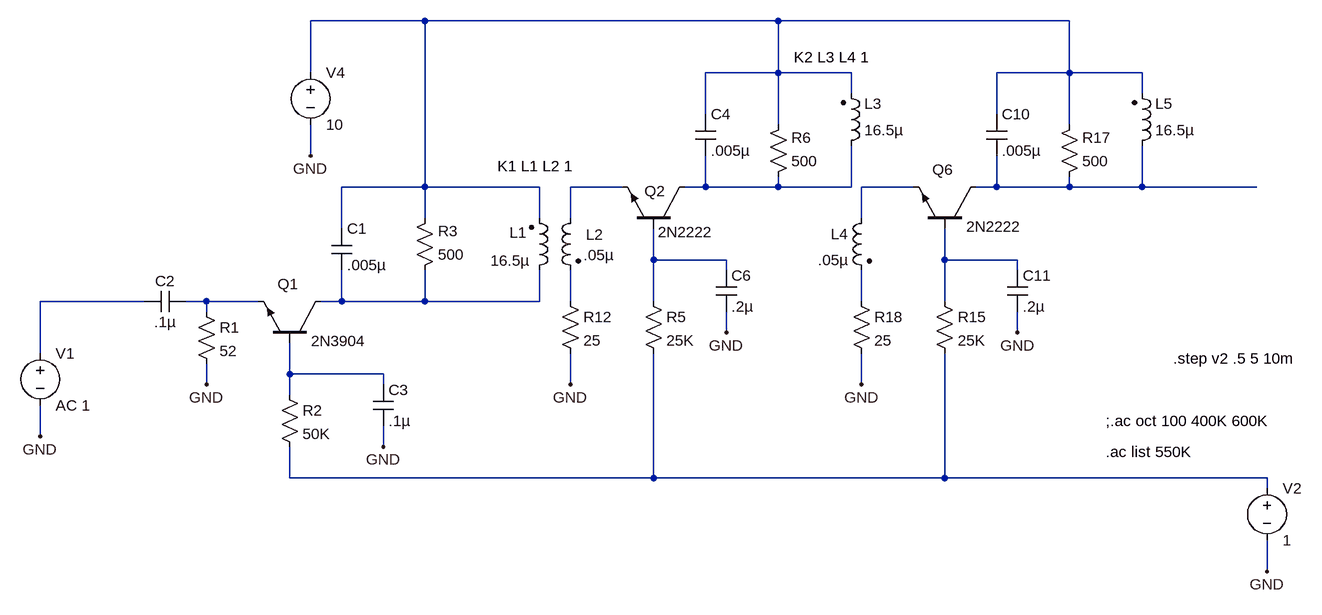
[diagram p0: schematic tmp.asc]
tmp.asc, the LTspice schematic file:
Version 4
SHEET 1 3740 1748
WIRE 1776 1312 1808 1312
WIRE 2112 1312 2112 1264
WIRE 1808 1312 1808 1264
WIRE 1808 1312 1936 1312
WIRE 1808 1136 1936 1136
WIRE 2112 1184 2112 1136
WIRE 1808 1200 1808 1136
WIRE 1680 1312 1600 1312
WIRE 1600 1312 1600 1328
WIRE 1600 1408 1600 1440
WIRE 1600 1312 1568 1312
WIRE 1344 1312 1344 1392
WIRE 1344 1472 1344 1520
WIRE 1728 1376 1728 1424
WIRE 1728 1536 1728 1584
WIRE 1728 1424 1728 1456
WIRE 1728 1424 1872 1424
WIRE 1872 1424 1872 1440
WIRE 1872 1504 1872 1536
WIRE 1936 1136 1936 880
WIRE 1936 1136 2112 1136
WIRE 1936 1136 1936 1184
WIRE 1936 1264 1936 1312
WIRE 1936 1312 2112 1312
WIRE 2336 1136 2368 1136
WIRE 2592 1136 2592 1072
WIRE 2368 1136 2368 1088
WIRE 2368 1136 2480 1136
WIRE 2368 960 2480 960
WIRE 2592 992 2592 960
WIRE 2368 1024 2368 960
WIRE 2240 1136 2160 1136
WIRE 2288 1200 2288 1248
WIRE 2288 1248 2288 1312
WIRE 2288 1248 2400 1248
WIRE 2400 1248 2400 1264
WIRE 2400 1328 2400 1360
WIRE 2480 960 2592 960
WIRE 2480 960 2480 1040
WIRE 2480 1120 2480 1136
WIRE 2480 1136 2592 1136
WIRE 2160 1136 2160 1184
WIRE 2160 1264 2160 1312
WIRE 1760 1088 1760 1040
WIRE 1760 960 1760 880
WIRE 1760 880 1936 880
WIRE 1936 880 2480 880
WIRE 2480 880 2928 880
WIRE 1504 1312 1344 1312
WIRE 2288 1392 2288 1584
WIRE 2288 1584 1728 1584
WIRE 3216 1136 3040 1136
WIRE 2160 1392 2160 1440
WIRE 2480 960 2480 880
WIRE 3232 1584 2736 1584
WIRE 3040 1136 3040 1072
WIRE 2816 1136 2816 1088
WIRE 2816 960 2928 960
WIRE 3040 992 3040 960
WIRE 2816 1024 2816 960
WIRE 2736 1200 2736 1248
WIRE 2736 1248 2736 1312
WIRE 2736 1248 2848 1248
WIRE 2848 1248 2848 1264
WIRE 2848 1328 2848 1360
WIRE 2928 960 3040 960
WIRE 2928 960 2928 1040
WIRE 2928 1120 2928 1136
WIRE 2608 1136 2608 1184
WIRE 2608 1264 2608 1312
WIRE 2736 1392 2736 1584
WIRE 2608 1392 2608 1440
WIRE 2928 960 2928 880
WIRE 2688 1136 2608 1136
WIRE 2816 1136 2784 1136
WIRE 3040 1136 2928 1136
WIRE 2736 1584 2288 1584
WIRE 2928 1136 2816 1136
WIRE 3232 1584 3232 1600
WIRE 3232 1680 3232 1728
FLAG 1600 1440 GND
FLAG 1344 1520 GND
FLAG 1872 1536 GND
FLAG 2400 1360 GND
FLAG 2160 1440 GND
FLAG 1760 1088 GND
FLAG 2848 1360 GND
FLAG 2608 1440 GND
FLAG 3232 1728 GND
SYMBOL npn 1776 1376 M270
WINDOW 0 91 67 VLeft 0
WINDOW 3 3 15 VLeft 0
SYMATTR InstName Q1
SYMATTR Value 2N3904
SYMBOL ind2 2096 1280 M180
WINDOW 0 -3 74 Right 0
WINDOW 3 2 31 Right 0
SYMATTR InstName L1
SYMATTR Value 16.5µ
SYMBOL cap 1792 1264 M180
WINDOW 0 24 64 Left 0
WINDOW 3 24 8 Left 0
SYMATTR InstName C1
SYMATTR Value .005µ
SYMBOL res 1584 1312 R0
SYMATTR InstName R1
SYMATTR Value 52
SYMBOL cap 1568 1296 R90
WINDOW 0 0 32 VBottom 0
WINDOW 3 32 32 VTop 0
SYMATTR InstName C2
SYMATTR Value .1µ
SYMBOL voltage 1344 1376 R0
SYMATTR InstName V1
SYMATTR Value AC 1
SYMBOL res 1712 1440 R0
SYMATTR InstName R2
SYMATTR Value 50K
SYMBOL cap 1856 1440 R0
SYMATTR InstName C3
SYMATTR Value .1µ
SYMBOL res 1920 1280 M180
WINDOW 0 36 76 Left 0
WINDOW 3 36 40 Left 0
SYMATTR InstName R3
SYMATTR Value 500
SYMBOL npn 2336 1200 M270
WINDOW 0 58 62 VLeft 0
WINDOW 3 -5 41 VLeft 0
SYMATTR InstName Q2
SYMATTR Value 2N2222
SYMBOL ind2 2576 1088 M180
WINDOW 0 36 80 Left 0
WINDOW 3 36 40 Left 0
SYMATTR InstName L3
SYMATTR Value 16.5µ
SYMBOL cap 2352 1088 M180
WINDOW 0 24 64 Left 0
WINDOW 3 24 8 Left 0
SYMATTR InstName C4
SYMATTR Value .005µ
SYMBOL res 2272 1296 R0
SYMATTR InstName R5
SYMATTR Value 25K
SYMBOL cap 2384 1264 R0
SYMATTR InstName C6
SYMATTR Value .2µ
SYMBOL res 2464 1136 M180
WINDOW 0 36 76 Left 0
WINDOW 3 36 40 Left 0
SYMATTR InstName R6
SYMATTR Value 500
SYMBOL ind2 2176 1168 M0
WINDOW 0 -8 41 Right 0
WINDOW 3 -4 73 Right 0
SYMATTR InstName L2
SYMATTR Value .05µ
SYMBOL voltage 1760 944 R0
SYMATTR InstName V4
SYMATTR Value 10
SYMBOL res 2144 1296 R0
SYMATTR InstName R12
SYMATTR Value 25
SYMBOL npn 2784 1200 M270
WINDOW 0 91 67 VLeft 0
WINDOW 3 3 15 VLeft 0
SYMATTR InstName Q6
SYMATTR Value 2N2222
SYMBOL ind2 3024 1088 M180
WINDOW 0 36 80 Left 0
WINDOW 3 36 40 Left 0
SYMATTR InstName L5
SYMATTR Value 16.5µ
SYMBOL cap 2800 1088 M180
WINDOW 0 24 64 Left 0
WINDOW 3 24 8 Left 0
SYMATTR InstName C10
SYMATTR Value .005µ
SYMBOL res 2720 1296 R0
SYMATTR InstName R15
SYMATTR Value 25K
SYMBOL cap 2832 1264 R0
SYMATTR InstName C11
SYMATTR Value .2µ
SYMBOL res 2912 1136 M180
WINDOW 0 36 76 Left 0
WINDOW 3 36 40 Left 0
SYMATTR InstName R17
SYMATTR Value 500
SYMBOL ind2 2624 1168 M0
SYMATTR InstName L4
SYMATTR Value .05µ
SYMBOL res 2592 1296 R0
SYMATTR InstName R18
SYMATTR Value 25
SYMBOL voltage 3232 1584 R0
SYMATTR InstName V2
SYMATTR Value 1
text 2048 1104 Left 0 !K1 L1 L2 1
text 2504 936 Left 0 !K2 L3 L4 1
text 2984 1496 Left 0 !;.ac oct 100 400K 600K
text 3088 1400 Left 0 !.step v2 .5 5 10m
text 2984 1544 Left 0 !.ac list 550K

The netlist it stands for:
* tmp.asc
Q1 N001 N005 N003 0 2N3904
L1 N001 N002 16.5µ
C1 N001 N002 .005µ
R1 N003 GND 52
C2 N003 N004 .1µ
V1 N004 GND AC 1
R2 N005 N006 50K
C3 N005 GND .1µ
R3 N001 N002 500
Q2 N007 N009 N008 0 2N2222
L3 N007 N002 16.5µ
C4 N007 N002 .005µ
R5 N009 N006 25K
C6 N009 GND .2µ
R6 N007 N002 500
L2 N008 N010 .05µ
V4 N002 GND 10
R12 N010 GND 25
Q6 N011 N012 N013 0 2N2222
L5 N011 N002 16.5µ
C10 N011 N002 .005µ
R15 N012 N006 25K
C11 N012 GND .2µ
R17 N011 N002 500
L4 N013 N014 .05µ
R18 N014 GND 25
V2 N006 GND 1
.model NPN NPN
.model PNP PNP
.lib standard.bjt
K1 L1 L2 1
K2 L3 L4 1
;.ac oct 100 400K 600K
.step v2 .5 5 10m
.ac list 550K
.backanno
.end